# Altium project PCB_Project_5.PrjPcb
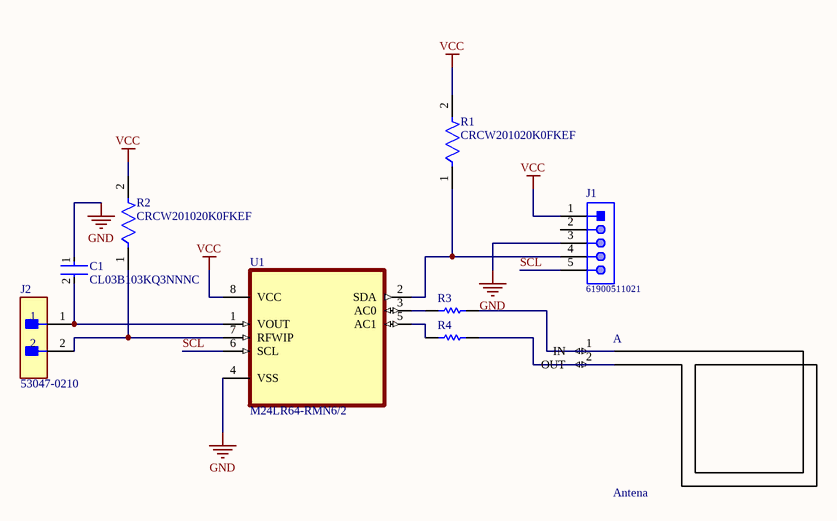
[diagram p0: Sheet1.SchDoc]
1 sheet, 9 parts. Net scope: global (net labels, ports and power ports of the same name join across sheets).
Board file: PCB1.PcbDoc

## Sheet Sheet1.SchDoc
size A4

### Parts
A  Antena  [Antena2]
C1  CL03B103KQ3NNNC  [FP-CL03-IPC_C]
J1  61900511021  [61900511021]
J2  53047-0210  [FP-53047-0210-MFG]
R1  CRCW201020K0FKEF  [FP-CRCW2010-e3-MFG]
R2  CRCW201020K0FKEF  [FP-CRCW2010-e3-MFG]
R3  RC1206FR-071RL  [RESC3116X65X40LL10T20]  (value not drawn)
R4  RC1206FR-071RL  [RESC3116X65X40LL10T20]  (value not drawn)
U1  M24LR64-RMN6/2  [SOIC127P600X175-8N]

### Nets
GND: C1.1 J1.3 U1.4(VSS)
VCC: J1.1 R1.2 R2.2 U1.8(VCC)
SCL: J1.5 U1.6(SCL)
NetA_1: A.1(IN) R3.2
NetA_2: A.2(OUT) R4.2
NetC1_2: C1.2 J2.1 U1.1(VOUT)
NetJ1_4: J1.4 R1.1 U1.2(SDA)
NetJ2_2: J2.2 R2.1 U1.7(RFWIP)
NetR3_1: R3.1 U1.3(AC0)
NetR4_1: R4.1 U1.5(AC1)

Not connected (* = marked no-connect by the designer): J1 2

### Library data of the parts
C1 = CMP-2010-00307-2: Cap Ceramic 10nF 6.3V X7R ±10% Pad SMD 0201 +125°C T/R; Tolerance: 10%; Width: 0.012inch; Min Operating Temperature: -55°C; Radiation Hardening: No; Capacitance: 10nF; Max Operating Temperature: 125°C; Case Code (Metric): 0603; Packaging: Tape and Reel; Dielectric: X7R; Thickness: 0.013inch; Height: 0.3mm; Length: 0.6mm; Case Code (Imperial): 0201; Depth: 0.3mm; Voltage Rating: 6.3V; Package Quantity: 1; Case/Package: 0201; Mount: Surface Mount
J1 = CMP-1502-00595-1: Male Bottom Locking Header WR-WTB, THT, Right Angled, pitch 2.54 mm, 1 x 5 position; Manufacturer: Wurth Elektronik; Working Voltage: 250VAC; Contact Resistance: 20mOhm; Position: 1x5; Pitch: 2.54mm; Package Reference: 61900511021; Packaging: Bag; Part Number: 61900511021; Operating Temperature: -40to105degC; Gender: Male; Publisher: WurthElektronik; Mounting Technology: THT; Orientation: RightAngled; Datasheet URL: https://katalog.we-online.de/em/datasheet/6190xx11021.pdf; Manufacturer URL: http://www.we-online.de
J2 = CMP-2000-05628-3: CONN HEADER VERT 2POS 1.25MM; Manufacturer: Molex; Conn Gender: Male; Voltage Rating: 125V; Conn Orientation: Vertical; Number Of Contacts: 2; Current Rating: 1A; Contact Material: Tin; Temperature Range Low: -40°C; ComponentLink2URL: http://www.molex.com/webdocs/datasheets/pdf/en-us/0530470210_PCB_HEADERS.pdf; Mouser Description: 1.25mm Pitch PicoBlade™ Wire-to-Board Header, Vertical, with Friction Lock, 2 Circuits; Manufacturer Part Number: 53047-0210; Temperature Range High: +85°C; ComponentLink2Description: Datasheet; Automotive: No; RoHS: TRUE; Ambient Temperature Range High: +85°C; Octopart: https://octopart.com/53047-0210-molex-276772; Footprint Url: https://www.molex.com/pdm_docs/sd/530470210_sd.pdf; Lead Free: Yes; Pitch: 1.25mm; Temperature: -40°C to +85°C; Device Class L2: Headers and Wire Housings; Package: 0; Ambient Temperature Range Low: -40°C; Digikey Description: CONN HEADER VERT 2POS 1.25MM; Category: Conn; Device Class L3: unset; Number Of Rows: 1; Device Class L1: Connectors; Height: 4.4mm
R1 R2 = CMP-1017-00655-2: RES Thick Film, 20kΩ, 1%, 0.75W, 100ppm/°C, 2010; Voltage Rating: 400V; Resistance: 20kR; Max Power Dissipation: 750mW; Lead Free: Lead Free; Weight: 0.000899oz; Package Quantity: 1; Depth: 2.5mm; Temperature Coefficient: 100ppm/°C; Case/Package: 2010; Contact Plating: Tin; Case Code (Metric): 5025; Features: Automotive AEC-Q200; Max Operating Temperature: 155°C; Packaging: Tape and Reel; Length: 5mm; Width: 0.098inch; Military Standard: Not; Min Operating Temperature: -55°C; Tolerance: 1%; Voltage Rating (DC): 400V; Power Rating: 750mW; Number of Pins: 2; Radiation Hardening: No; Case Code (Imperial): 2010; Height: 0.028inch; Composition: Thick Film; Number of Terminations: 2
R3 = CMP-2000-06967-1: Chip Resistor, 1 Ohm, +/- 1%, 250 mW, -55 to 155 degC, 1206 (3216 Metric), RoHS, Tape and Reel; Manufacturer: Yageo; Resistance: 0Ohms; Power Rating: 250mW(1/4W); Temperature Coefficient: 200PPM/C; Voltage Rating: 200V; Case Code - mm: 3216; Package Description: 2-Pin Surface Mount Device, Body 3.1 x 1.6 mm; Packaging: Reel; Product: ThickFilmResistorsGeneralPurpose; Datasheet URL: http://www.yageo.com/documents/recent/PYu-RC_Group_51_RoHS_L_7.pdf; Case Code - in: 1206; Series: RC; Termination Style: SMD/SMT; Datasheet Version: Rev. 7, 05/2017; Manufacturer URL: http://www.yageo.com/; Mounting Technology: SurfaceMount; Operating Temperature Range: -55Cto+155C; Package Reference: 1206; Tolerance: 1%
R4 = CMP-2000-06967-1: Chip Resistor, 1 Ohm, +/- 1%, 250 mW, -55 to 155 degC, 1206 (3216 Metric), RoHS, Tape and Reel; Manufacturer: Yageo; Resistance: 0; Power Rating: 250mW(1/4W); Temperature Coefficient: 200PPM/C; Voltage Rating: 200V; Case Code - mm: 3216; Package Description: 2-Pin Surface Mount Device, Body 3.1 x 1.6 mm; Packaging: Reel; Product: ThickFilmResistorsGeneralPurpose; Datasheet URL: http://www.yageo.com/documents/recent/PYu-RC_Group_51_RoHS_L_7.pdf; Case Code - in: 1206; Series: RC; Termination Style: SMD/SMT; Datasheet Version: Rev. 7, 05/2017; Manufacturer URL: http://www.yageo.com/; Mounting Technology: SurfaceMount; Operating Temperature Range: -55Cto+155C; Package Reference: 1206; Tolerance: 1%
U1 = M24LR64-RMN6/2: 64 Kbit EEPROM; MP: M24LR64-RMN6-2; Package: None; Price: None; Value: *; Availability: Unavailable